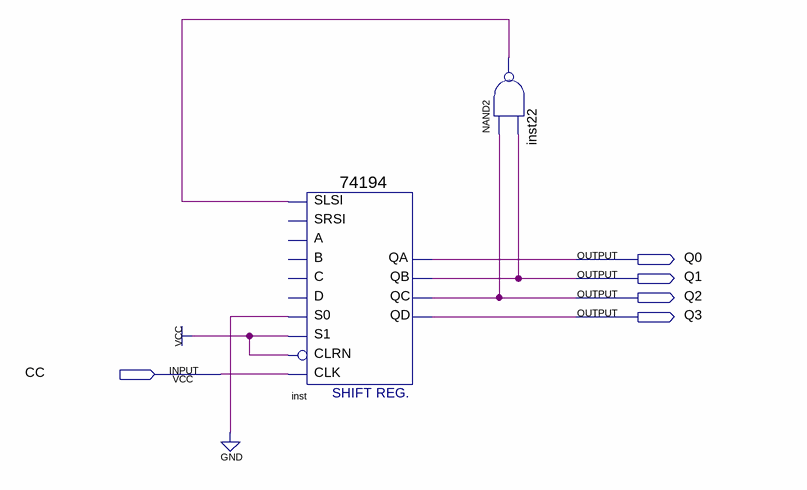
[diagram p0: schematic sheet]
// Quartus schematic T_14194.bdf as structural Verilog: 2 symbols, 5 pins
module T_14194 (
  input  CC,
  output Q0,
  output Q1,
  output Q2,
  output Q3
);

  wire inst22_out;

  \74194  inst (
    .SLSI(inst22_out), .CLK(CC), .CLRN(1'b1), .S1(1'b1), .S0(1'b0), .QA(Q0), .QB(Q1), .QC(Q2), .QD(Q3));  // open: SRSI, B, C, D, A
  nand inst22 (inst22_out, Q2, Q1);
endmodule
